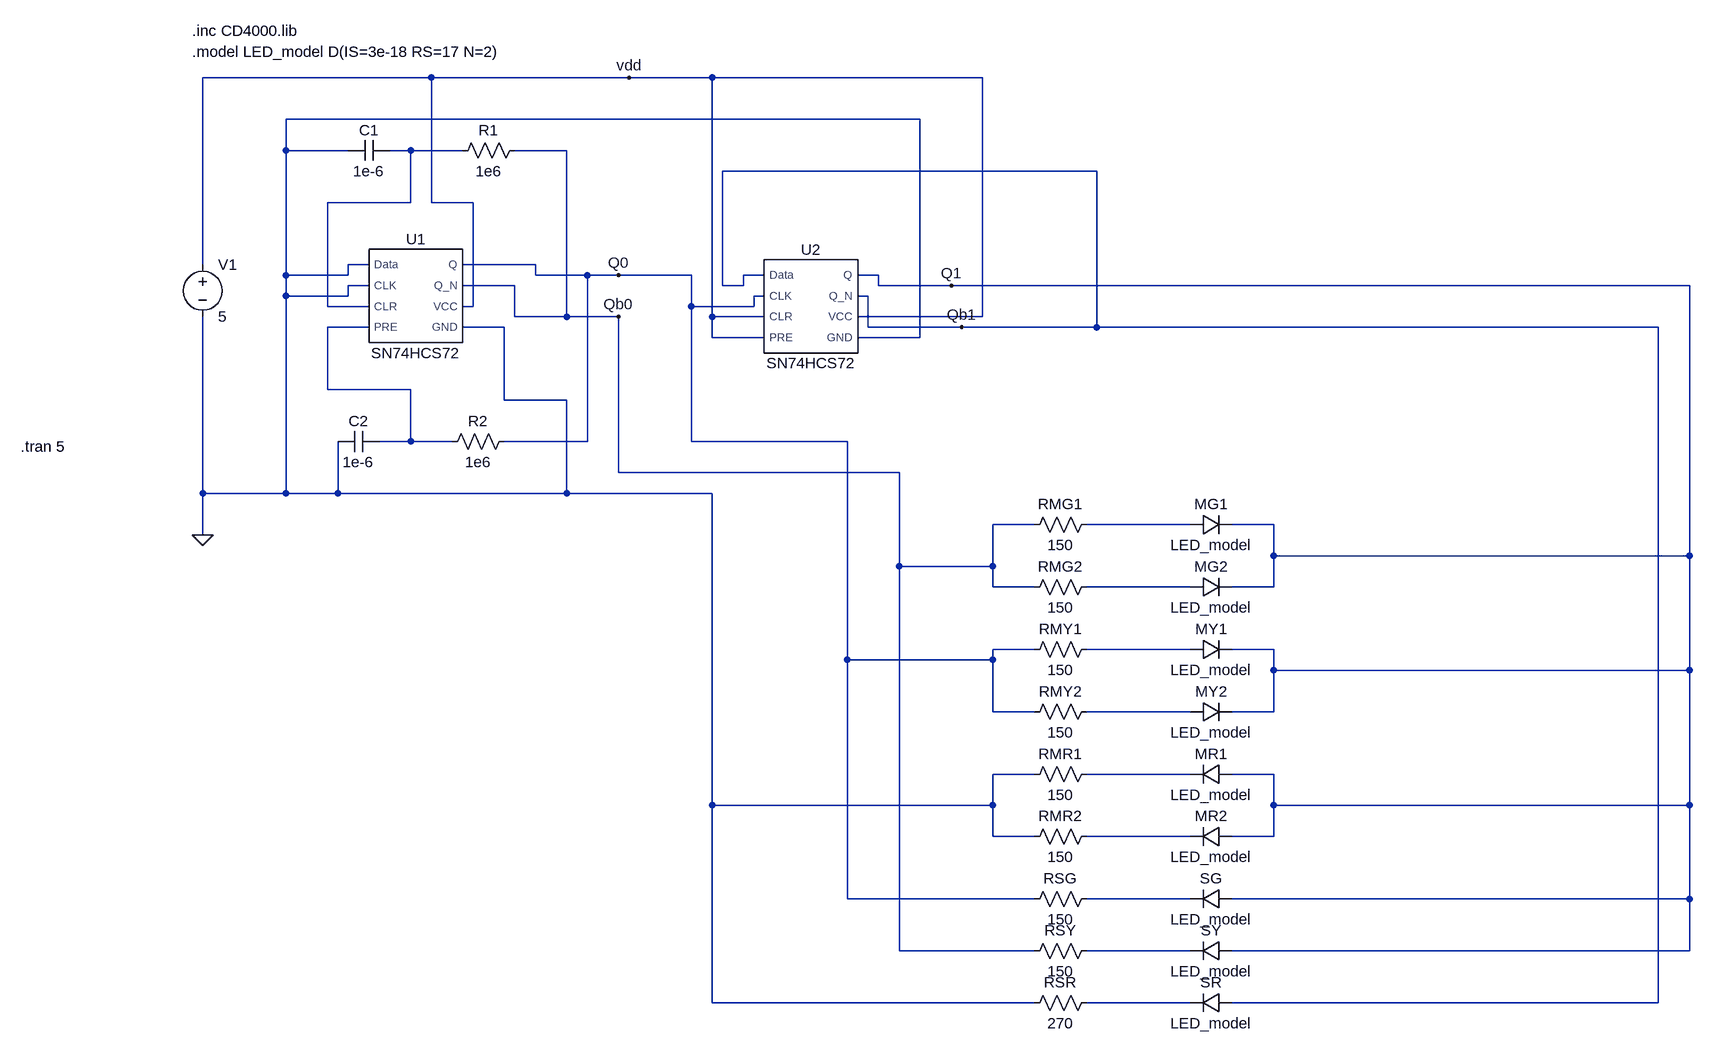
[diagram p0: schematic Soldering_Sim.asc]
Soldering_Sim.asc, the LTspice schematic file:
Version 4
SHEET 1 2968 1264
WIRE 1008 -240 656 -240
WIRE 1312 -240 1008 -240
WIRE 1440 -240 1312 -240
WIRE 1856 -240 1440 -240
WIRE 1760 -176 784 -176
WIRE 784 -128 784 -176
WIRE 880 -128 784 -128
WIRE 976 -128 944 -128
WIRE 1056 -128 976 -128
WIRE 1216 -128 1136 -128
WIRE 2032 -96 1456 -96
WIRE 976 -48 976 -128
WIRE 976 -48 848 -48
WIRE 1008 -48 1008 -240
WIRE 1072 -48 1008 -48
WIRE 656 48 656 -240
WIRE 912 48 880 48
WIRE 1168 48 1056 48
WIRE 784 64 784 -128
WIRE 880 64 880 48
WIRE 880 64 784 64
WIRE 1168 64 1168 48
WIRE 1248 64 1168 64
WIRE 1296 64 1248 64
WIRE 1408 64 1296 64
WIRE 1520 64 1488 64
WIRE 1696 64 1664 64
WIRE 912 80 880 80
WIRE 1136 80 1056 80
WIRE 1456 80 1456 -96
WIRE 1488 80 1488 64
WIRE 1488 80 1456 80
WIRE 1696 80 1696 64
WIRE 1808 80 1696 80
WIRE 2944 80 1808 80
WIRE 784 96 784 64
WIRE 880 96 880 80
WIRE 880 96 784 96
WIRE 1520 96 1504 96
WIRE 1680 96 1664 96
WIRE 848 112 848 -48
WIRE 912 112 848 112
WIRE 1072 112 1072 -48
WIRE 1072 112 1056 112
WIRE 1408 112 1408 64
WIRE 1504 112 1504 96
WIRE 1504 112 1408 112
WIRE 1136 128 1136 80
WIRE 1216 128 1216 -128
WIRE 1216 128 1136 128
WIRE 1296 128 1216 128
WIRE 1440 128 1440 -240
WIRE 1520 128 1440 128
WIRE 1856 128 1856 -240
WIRE 1856 128 1664 128
WIRE 912 144 848 144
WIRE 1120 144 1056 144
WIRE 1680 144 1680 96
WIRE 1824 144 1680 144
WIRE 2032 144 2032 -96
WIRE 2032 144 1824 144
WIRE 2896 144 2032 144
WIRE 1440 160 1440 128
WIRE 1520 160 1440 160
WIRE 1760 160 1760 -176
WIRE 1760 160 1664 160
WIRE 848 240 848 144
WIRE 976 240 848 240
WIRE 1120 256 1120 144
WIRE 1216 256 1120 256
WIRE 976 320 976 240
WIRE 976 320 928 320
WIRE 1040 320 976 320
WIRE 1248 320 1248 64
WIRE 1248 320 1120 320
WIRE 1408 320 1408 112
WIRE 1648 320 1408 320
WIRE 1296 368 1296 128
WIRE 1728 368 1296 368
WIRE 656 400 656 128
WIRE 784 400 784 96
WIRE 784 400 656 400
WIRE 864 400 864 320
WIRE 864 400 784 400
WIRE 1216 400 1216 256
WIRE 1216 400 864 400
WIRE 1440 400 1216 400
WIRE 1936 448 1872 448
WIRE 2176 448 2016 448
WIRE 2304 448 2240 448
WIRE 656 464 656 400
WIRE 2304 496 2304 448
WIRE 2944 496 2944 80
WIRE 2944 496 2304 496
WIRE 1728 512 1728 368
WIRE 1872 512 1872 448
WIRE 1872 512 1728 512
WIRE 1872 544 1872 512
WIRE 1936 544 1872 544
WIRE 2176 544 2016 544
WIRE 2304 544 2304 496
WIRE 2304 544 2240 544
WIRE 1936 640 1872 640
WIRE 2176 640 2016 640
WIRE 2304 640 2240 640
WIRE 1648 656 1648 320
WIRE 1872 656 1872 640
WIRE 1872 656 1648 656
WIRE 2304 672 2304 640
WIRE 2944 672 2944 496
WIRE 2944 672 2304 672
WIRE 1872 736 1872 656
WIRE 1936 736 1872 736
WIRE 2176 736 2016 736
WIRE 2304 736 2304 672
WIRE 2304 736 2240 736
WIRE 1936 832 1872 832
WIRE 2176 832 2016 832
WIRE 2304 832 2240 832
WIRE 1440 880 1440 400
WIRE 1872 880 1872 832
WIRE 1872 880 1440 880
WIRE 2304 880 2304 832
WIRE 2944 880 2944 672
WIRE 2944 880 2304 880
WIRE 1872 928 1872 880
WIRE 1936 928 1872 928
WIRE 2176 928 2016 928
WIRE 2304 928 2304 880
WIRE 2304 928 2240 928
WIRE 1648 1024 1648 656
WIRE 1936 1024 1648 1024
WIRE 2176 1024 2016 1024
WIRE 2944 1024 2944 880
WIRE 2944 1024 2240 1024
WIRE 1728 1104 1728 512
WIRE 1936 1104 1728 1104
WIRE 2176 1104 2016 1104
WIRE 2944 1104 2944 1024
WIRE 2944 1104 2240 1104
WIRE 1440 1184 1440 880
WIRE 1936 1184 1440 1184
WIRE 2176 1184 2016 1184
WIRE 2896 1184 2896 144
WIRE 2896 1184 2240 1184
FLAG 656 464 0
FLAG 1312 -240 vdd
FLAG 1296 64 Q0
FLAG 1296 128 Qb0
FLAG 1808 80 Q1
FLAG 1824 144 Qb1
SYMBOL res 1152 -144 R90
WINDOW 0 0 56 VBottom 2
WINDOW 3 32 56 VTop 2
SYMATTR InstName R1
SYMATTR Value 1e6
SYMBOL res 1136 304 R90
WINDOW 0 0 56 VBottom 2
WINDOW 3 32 56 VTop 2
SYMATTR InstName R2
SYMATTR Value 1e6
SYMBOL cap 944 -144 R90
WINDOW 0 0 32 VBottom 2
WINDOW 3 32 32 VTop 2
SYMATTR InstName C1
SYMATTR Value 1e-6
SYMATTR SpiceLine IC=5
SYMBOL cap 928 304 R90
WINDOW 0 0 32 VBottom 2
WINDOW 3 32 32 VTop 2
SYMATTR InstName C2
SYMATTR Value 1e-6
SYMATTR SpiceLine IC=0
SYMBOL voltage 656 32 R0
WINDOW 123 0 0 Left 0
WINDOW 39 0 0 Left 0
SYMATTR InstName V1
SYMATTR Value 5
SYMBOL res 2032 432 R90
WINDOW 0 0 56 VBottom 2
WINDOW 3 32 56 VTop 2
SYMATTR InstName RMG1
SYMATTR Value 150
SYMBOL res 2032 624 R90
WINDOW 0 0 56 VBottom 2
WINDOW 3 32 56 VTop 2
SYMATTR InstName RMY1
SYMATTR Value 150
SYMBOL res 2032 816 R90
WINDOW 0 0 56 VBottom 2
WINDOW 3 32 56 VTop 2
SYMATTR InstName RMR1
SYMATTR Value 150
SYMBOL res 2032 528 R90
WINDOW 0 0 56 VBottom 2
WINDOW 3 32 56 VTop 2
SYMATTR InstName RMG2
SYMATTR Value 150
SYMBOL res 2032 720 R90
WINDOW 0 0 56 VBottom 2
WINDOW 3 32 56 VTop 2
SYMATTR InstName RMY2
SYMATTR Value 150
SYMBOL res 2032 912 R90
WINDOW 0 0 56 VBottom 2
WINDOW 3 32 56 VTop 2
SYMATTR InstName RMR2
SYMATTR Value 150
SYMBOL res 2032 1008 R90
WINDOW 0 0 56 VBottom 2
WINDOW 3 32 56 VTop 2
SYMATTR InstName RSG
SYMATTR Value 150
SYMBOL res 2032 1088 R90
WINDOW 0 0 56 VBottom 2
WINDOW 3 32 56 VTop 2
SYMATTR InstName RSY
SYMATTR Value 150
SYMBOL res 2032 1168 R90
WINDOW 0 0 56 VBottom 2
WINDOW 3 32 56 VTop 2
SYMATTR InstName RSR
SYMATTR Value 270
SYMBOL diode 2176 464 R270
WINDOW 0 32 32 VTop 2
WINDOW 3 0 32 VBottom 2
SYMATTR InstName MG1
SYMATTR Value LED_model
SYMBOL diode 2176 656 R270
WINDOW 0 32 32 VTop 2
WINDOW 3 0 32 VBottom 2
SYMATTR InstName MY1
SYMATTR Value LED_model
SYMBOL diode 2176 560 R270
WINDOW 0 32 32 VTop 2
WINDOW 3 0 32 VBottom 2
SYMATTR InstName MG2
SYMATTR Value LED_model
SYMBOL diode 2176 752 R270
WINDOW 0 32 32 VTop 2
WINDOW 3 0 32 VBottom 2
SYMATTR InstName MY2
SYMATTR Value LED_model
SYMBOL diode 2240 848 M270
WINDOW 0 32 32 VTop 2
WINDOW 3 0 32 VBottom 2
SYMATTR InstName MR1
SYMATTR Value LED_model
SYMBOL diode 2240 944 M270
WINDOW 0 32 32 VTop 2
WINDOW 3 0 32 VBottom 2
SYMATTR InstName MR2
SYMATTR Value LED_model
SYMBOL diode 2240 1040 M270
WINDOW 0 32 32 VTop 2
WINDOW 3 0 32 VBottom 2
SYMATTR InstName SG
SYMATTR Value LED_model
SYMBOL diode 2240 1120 M270
WINDOW 0 32 32 VTop 2
WINDOW 3 0 32 VBottom 2
SYMATTR InstName SY
SYMATTR Value LED_model
SYMBOL diode 2240 1200 M270
WINDOW 0 32 32 VTop 2
WINDOW 3 0 32 VBottom 2
SYMATTR InstName SR
SYMATTR Value LED_model
SYMBOL AutoGenerated\\SN74HCS72 976 96 R0
SYMATTR InstName U1
SYMBOL AutoGenerated\\SN74HCS72 1584 112 R0
SYMATTR InstName U2
TEXT 640 -312 Left 2 !.inc CD4000.lib
TEXT 376 328 Left 2 !.tran 5
TEXT 640 -280 Left 2 !.model LED_model D(IS=3e-18 RS=17 N=2)

The netlist it stands for:
* Soldering_Sim.asc
R1 Qb0 N001 1e6
R2 Q0 N002 1e6
C1 N001 0 1e-6 IC=5
C2 N002 0 1e-6 IC=0
V1 vdd 0 5
RMG1 N003 Qb0 150
RMY1 N005 Q0 150
RMR1 N007 0 150
RMG2 N004 Qb0 150
RMY2 N006 Q0 150
RMR2 N008 0 150
RSG N009 Q0 150
RSY N010 Qb0 150
RSR N011 0 270
D§MG1 N003 Q1 LED_model
D§MY1 N005 Q1 LED_model
D§MG2 N004 Q1 LED_model
D§MY2 N006 Q1 LED_model
D§MR1 Q1 N007 LED_model
D§MR2 Q1 N008 LED_model
D§SG Q1 N009 LED_model
D§SY Q1 N010 LED_model
D§SR Qb1 N011 LED_model
XU1 0 0 N001 N002 Q0 Qb0 vdd 0 SN74HCS72  ; pins Data CLK CLR PRE Q Q_N VCC GND
XU2 Qb1 Q0 vdd vdd Q1 Qb1 vdd 0 SN74HCS72  ; pins Data CLK CLR PRE Q Q_N VCC GND
.model D D
.lib standard.dio
.inc CD4000.lib
.tran 5
.model LED_model D(IS=3e-18 RS=17 N=2)
.lib \\iona.sms.ed.ac.uk\home\s1906039\Win7\Desktop\SN74HCS72.CIR
.backanno
.end